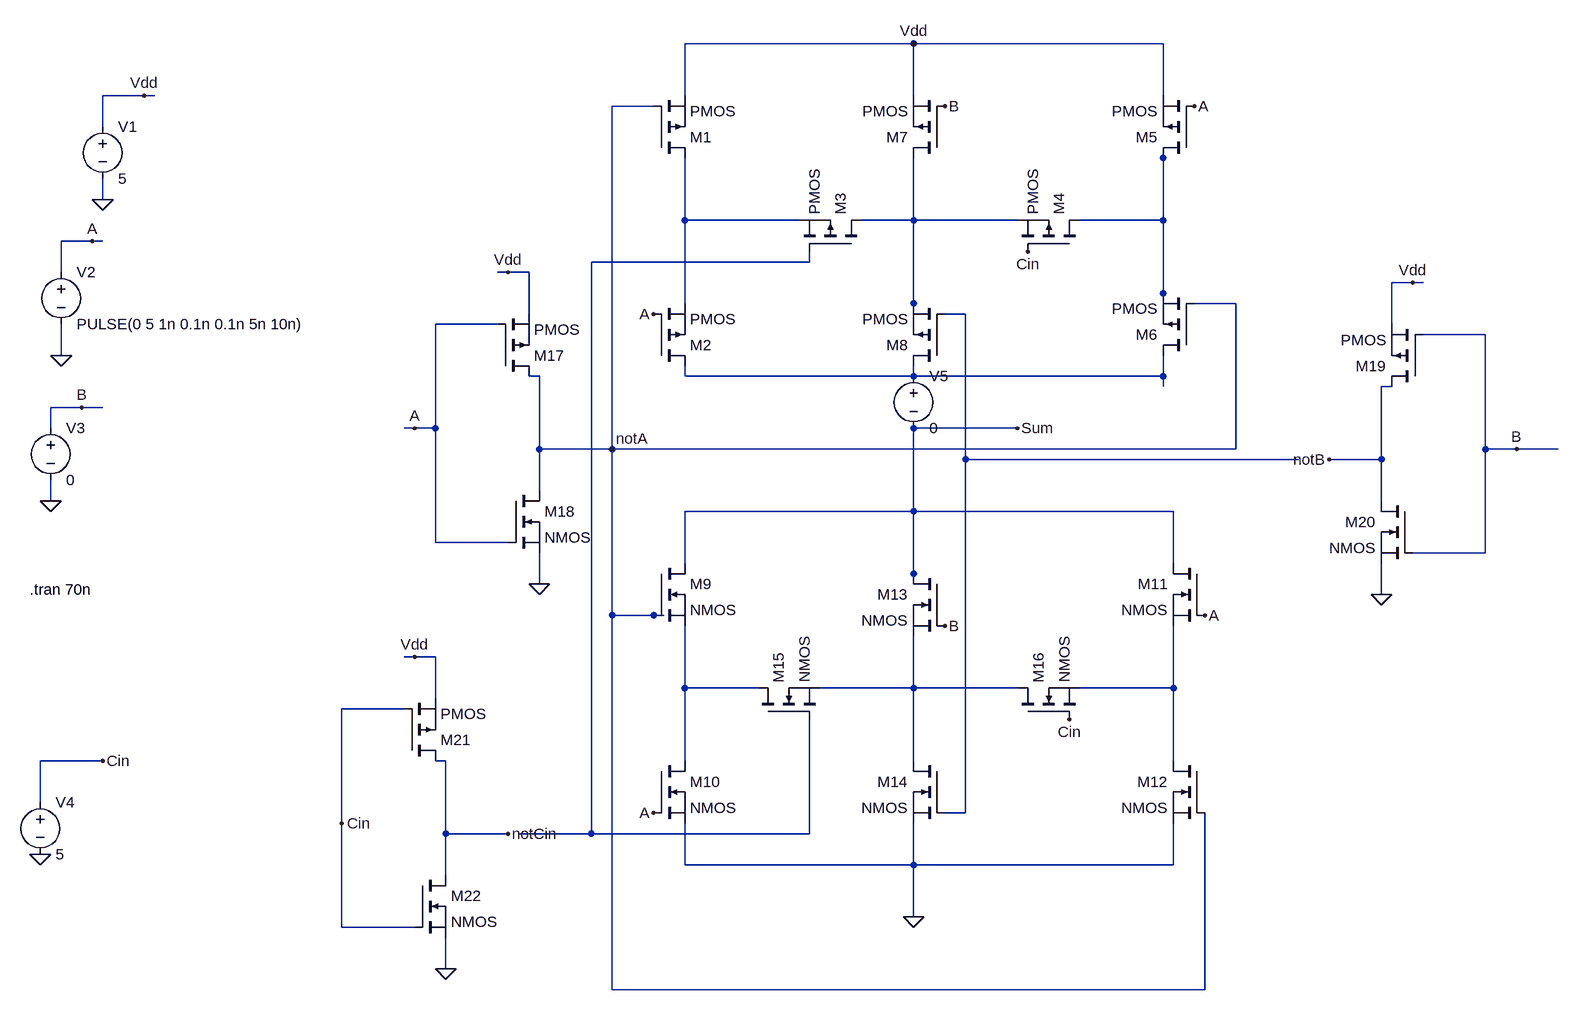
[diagram p0: schematic Sum1.asc]
Sum1.asc, the LTspice schematic file:
Version 4
SHEET 1 1396 1220
WIRE 400 -240 48 -240
WIRE 784 -240 400 -240
WIRE -784 -160 -848 -160
WIRE -768 -160 -784 -160
WIRE 48 -160 48 -240
WIRE 400 -160 400 -240
WIRE 784 -160 784 -240
WIRE 0 -144 -64 -144
WIRE -848 -112 -848 -160
WIRE 784 -64 784 -80
WIRE -848 0 -848 -32
WIRE 48 32 48 -64
WIRE 224 32 48 32
WIRE 400 32 400 -64
WIRE 400 32 320 32
WIRE 560 32 400 32
WIRE 784 32 784 -64
WIRE 784 32 656 32
WIRE -864 64 -912 64
WIRE -848 64 -864 64
WIRE 240 96 240 80
WIRE 240 96 -96 96
WIRE -912 112 -912 64
WIRE -224 112 -240 112
WIRE -192 112 -224 112
WIRE 1168 128 1136 128
WIRE 1184 128 1168 128
WIRE 784 144 784 32
WIRE 48 160 48 32
WIRE 400 160 400 32
WIRE 784 160 784 144
WIRE 896 160 832 160
WIRE -192 176 -192 112
WIRE 400 176 400 160
WIRE 480 176 448 176
WIRE -240 192 -336 192
WIRE 1136 192 1136 128
WIRE 1280 208 1184 208
WIRE -912 240 -912 192
WIRE -176 272 -192 272
WIRE 48 272 48 256
WIRE 400 272 400 256
WIRE 400 272 48 272
WIRE 784 272 784 240
WIRE 784 272 400 272
WIRE 784 288 784 272
WIRE 1136 288 1120 288
WIRE -880 320 -928 320
WIRE -848 320 -880 320
WIRE -928 352 -928 320
WIRE -368 352 -384 352
WIRE -336 352 -336 192
WIRE -336 352 -368 352
WIRE 560 352 400 352
WIRE -176 384 -176 272
WIRE -64 384 -64 -144
WIRE -64 384 -176 384
WIRE 896 384 896 160
WIRE 896 384 -64 384
WIRE 1280 384 1280 208
WIRE 1328 384 1280 384
WIRE 1392 384 1328 384
WIRE 480 400 480 176
WIRE 992 400 480 400
WIRE 1120 400 1120 288
WIRE 1120 400 1040 400
WIRE -176 448 -176 384
WIRE -928 464 -928 432
WIRE 1120 464 1120 400
WIRE 400 480 400 352
WIRE 400 480 48 480
WIRE 800 480 400 480
WIRE -336 528 -336 352
WIRE -224 528 -336 528
WIRE 1280 544 1280 384
WIRE 1280 544 1168 544
WIRE 48 560 48 480
WIRE 800 560 800 480
WIRE 400 576 400 480
WIRE -176 592 -176 544
WIRE 400 592 400 576
WIRE 1120 608 1120 560
WIRE -64 640 -64 384
WIRE 0 640 -64 640
WIRE 16 640 0 640
WIRE -368 704 -384 704
WIRE -336 704 -368 704
WIRE 48 752 48 656
WIRE 160 752 48 752
WIRE 400 752 400 672
WIRE 400 752 256 752
WIRE 560 752 400 752
WIRE 800 752 800 656
WIRE 800 752 656 752
WIRE -336 768 -336 704
WIRE -384 784 -480 784
WIRE -848 864 -944 864
WIRE -320 864 -336 864
WIRE 48 864 48 752
WIRE 400 864 400 752
WIRE 800 864 800 752
WIRE -944 928 -944 864
WIRE 480 944 480 400
WIRE 480 944 448 944
WIRE -480 960 -480 784
WIRE -320 976 -320 864
WIRE -224 976 -320 976
WIRE -96 976 -96 96
WIRE -96 976 -208 976
WIRE 240 976 240 800
WIRE 240 976 -96 976
WIRE 48 1024 48 960
WIRE 400 1024 400 960
WIRE 400 1024 48 1024
WIRE 800 1024 800 960
WIRE 800 1024 400 1024
WIRE -320 1040 -320 976
WIRE 400 1104 400 1024
WIRE -480 1120 -480 960
WIRE -368 1120 -480 1120
WIRE -320 1184 -320 1136
WIRE -64 1216 -64 640
WIRE 848 1216 848 944
WIRE 848 1216 -64 1216
FLAG -848 0 0
FLAG -784 -160 Vdd
FLAG -912 240 0
FLAG -928 464 0
FLAG -864 64 A
FLAG -880 320 B
FLAG 400 -240 Vdd
FLAG -176 592 0
FLAG -224 112 Vdd
FLAG -368 352 A
FLAG -64 384 notA
FLAG 1120 608 0
FLAG 1168 128 Vdd
FLAG 1328 384 B
FLAG 1040 400 notB
FLAG 0 176 A
FLAG 832 -144 A
FLAG 448 -144 B
FLAG 0 944 A
FLAG 848 640 A
FLAG 448 656 B
FLAG -944 1008 0
FLAG -848 864 Cin
FLAG -320 1184 0
FLAG -368 704 Vdd
FLAG -480 960 Cin
FLAG -224 976 notCin
FLAG 560 352 Sum
FLAG 576 80 Cin
FLAG 640 800 Cin
FLAG 400 1104 0
SYMBOL voltage -848 -128 R0
WINDOW 123 0 0 Left 2
WINDOW 39 0 0 Left 2
SYMATTR InstName V1
SYMATTR Value 5
SYMBOL voltage -912 96 R0
WINDOW 123 0 0 Left 2
WINDOW 39 0 0 Left 2
SYMATTR InstName V2
SYMATTR Value PULSE(0 5 1n 0.1n 0.1n 5n 10n)
SYMBOL voltage -928 336 R0
WINDOW 123 0 0 Left 2
WINDOW 39 0 0 Left 2
SYMATTR InstName V3
SYMATTR Value 0
SYMBOL pmos 0 -64 M180
SYMATTR InstName M1
SYMBOL pmos 0 256 M180
SYMATTR InstName M2
SYMBOL pmos 832 -64 R180
SYMATTR InstName M5
SYMBOL pmos 832 240 R180
SYMATTR InstName M6
SYMBOL pmos 448 -64 R180
SYMATTR InstName M7
SYMBOL pmos 448 256 R180
SYMATTR InstName M8
SYMBOL nmos 0 560 R0
SYMATTR InstName M9
SYMBOL nmos 0 864 R0
SYMATTR InstName M10
SYMBOL nmos 848 560 M0
SYMATTR InstName M11
SYMBOL nmos 848 864 M0
SYMATTR InstName M12
SYMBOL nmos 448 576 M0
SYMATTR InstName M13
SYMBOL nmos 448 864 M0
SYMATTR InstName M14
SYMBOL pmos -240 272 M180
SYMATTR InstName M17
SYMBOL nmos -224 448 R0
SYMATTR InstName M18
SYMBOL pmos 1184 288 R180
SYMATTR InstName M19
SYMBOL nmos 1168 464 M0
SYMATTR InstName M20
SYMBOL voltage -944 912 R0
WINDOW 123 0 0 Left 0
WINDOW 39 0 0 Left 0
SYMATTR InstName V4
SYMATTR Value 5
SYMBOL pmos -384 864 M180
SYMATTR InstName M21
SYMBOL nmos -368 1040 R0
SYMATTR InstName M22
SYMBOL pmos 320 80 M270
SYMATTR InstName M3
SYMBOL pmos 656 80 M270
SYMATTR InstName M4
SYMBOL nmos 160 800 R270
SYMATTR InstName M15
SYMBOL nmos 560 800 R270
SYMATTR InstName M16
SYMBOL voltage 400 256 R0
WINDOW 123 0 0 Left 0
WINDOW 39 0 0 Left 0
SYMATTR InstName V5
SYMATTR Value 0
TEXT -960 600 Left 2 !.tran 70n

The netlist it stands for:
* Sum1.asc
V1 Vdd 0 5
V2 A 0 PULSE(0 5 1n 0.1n 0.1n 5n 10n)
V3 B 0 0
M1 N002 notA Vdd Vdd PMOS
M2 N006 A N002 N002 PMOS
M5 N001 A Vdd Vdd PMOS
M6 N006 notA N001 N001 PMOS
M7 N003 B Vdd Vdd PMOS
M8 N006 N005 N003 N003 PMOS
M9 Sum notA N007 N007 NMOS
M10 N007 A 0 0 NMOS
M11 Sum A N009 N009 NMOS
M12 N009 notA 0 0 NMOS
M13 Sum B N008 N008 NMOS
M14 N008 N005 0 0 NMOS
M17 notA A Vdd Vdd PMOS
M18 notA A 0 0 NMOS
M19 notB B Vdd Vdd PMOS
M20 notB B 0 0 NMOS
V4 Cin 0 5
M21 notCin Cin Vdd Vdd PMOS
M22 notCin Cin 0 0 NMOS
M3 N003 N004 N002 N002 PMOS
M4 N001 Cin N003 N003 PMOS
M15 N007 N004 N008 N008 NMOS
M16 N008 Cin N009 N009 NMOS
V5 N006 Sum 0
.model NMOS NMOS
.model PMOS PMOS
.lib standard.mos
.tran 70n
.backanno
.end